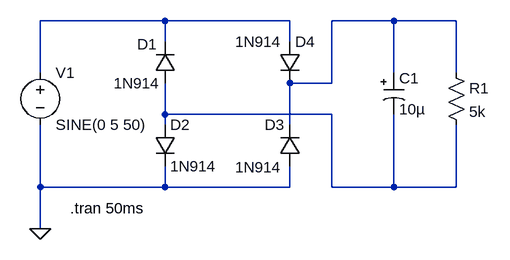
[diagram p0: schematic Draft2.asc]
Draft2.asc, the LTspice schematic file:
Version 4
SHEET 1 880 680
WIRE 272 0 80 0
WIRE 464 0 272 0
WIRE 624 0 528 0
WIRE 720 0 624 0
WIRE 272 32 272 0
WIRE 464 32 464 0
WIRE 80 80 80 0
WIRE 624 80 624 0
WIRE 720 80 720 0
WIRE 528 96 528 0
WIRE 528 96 464 96
WIRE 272 144 272 96
WIRE 528 144 272 144
WIRE 272 160 272 144
WIRE 464 160 464 96
WIRE 80 256 80 160
WIRE 272 256 272 224
WIRE 272 256 80 256
WIRE 464 256 464 224
WIRE 464 256 272 256
WIRE 528 256 528 144
WIRE 624 256 624 144
WIRE 624 256 528 256
WIRE 720 256 720 160
WIRE 720 256 624 256
WIRE 80 320 80 256
FLAG 80 320 0
SYMBOL voltage 80 64 R0
WINDOW 123 0 0 Left 0
WINDOW 39 0 0 Left 0
SYMATTR InstName V1
SYMATTR Value SINE(0 5 50)
SYMBOL diode 288 96 R180
WINDOW 0 28 60 Left 2
WINDOW 3 24 0 Left 2
SYMATTR InstName D1
SYMATTR Value 1N914
SYMBOL diode 256 160 R0
SYMATTR InstName D2
SYMATTR Value 1N914
SYMBOL diode 480 224 R180
WINDOW 0 24 64 Left 2
WINDOW 3 29 -1 Left 2
SYMATTR InstName D3
SYMATTR Value 1N914
SYMBOL diode 448 32 R0
WINDOW 3 -68 0 Left 2
SYMATTR InstName D4
SYMATTR Value 1N914
SYMBOL res 704 64 R0
SYMATTR InstName R1
SYMATTR Value 5k
SYMBOL polcap 608 80 R0
WINDOW 3 24 56 Left 2
SYMATTR InstName C1
SYMATTR Value 10µ
SYMATTR Description Capacitor
SYMATTR Type cap
SYMATTR SpiceLine V=6.3 Irms=0 Rser=4 Lser=0 mfg="AVX" pn="TAJA106M006" type="Tantalum"
TEXT 126 288 Left 2 !.tran 50ms

The netlist it stands for:
* Draft2.asc
V1 N001 0 SINE(0 5 50)
D1 N003 N001 1N914
D2 N003 0 1N914
D3 0 N002 1N914
D4 N001 N002 1N914
R1 N002 N003 5k
C1 N002 N003 10µ V=6.3 Irms=0 Rser=4 Lser=0 mfg="AVX" pn="TAJA106M006" type="Tantalum"
.model D D
.lib standard.dio
.tran 50ms
.backanno
.end